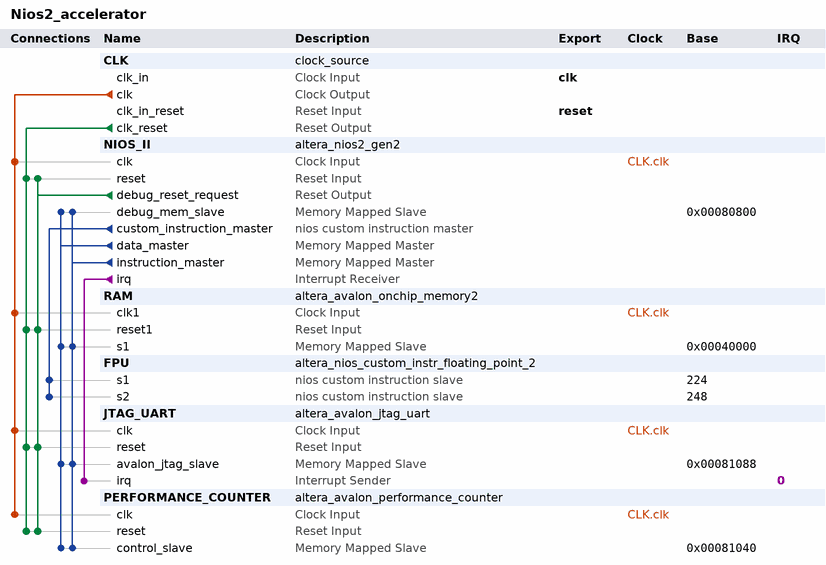
[diagram p0: system contents]
# Platform Designer (Qsys) system Nios2_accelerator, Cyclone V 5CEBA2F17A7
# Parameters at their usual value, and those the tool derives, are not listed.
package require -exact qsys 18.0
create_system Nios2_accelerator
set_project_property DEVICE_FAMILY {Cyclone V}
set_project_property DEVICE 5CEBA2F17A7

add_instance CLK clock_source 18.0
set_instance_parameter_value CLK clockFrequency 50000000

add_instance NIOS_II altera_nios2_gen2 18.0
set_instance_parameter_value NIOS_II dcache_size 2048
set_instance_parameter_value NIOS_II exceptionSlave RAM.s1
set_instance_parameter_value NIOS_II icache_size 4096
set_instance_parameter_value NIOS_II impl Tiny
set_instance_parameter_value NIOS_II resetSlave RAM.s1

add_instance RAM altera_avalon_onchip_memory2 18.0
set_instance_parameter_value RAM dataWidth 32
set_instance_parameter_value RAM dualPort false
set_instance_parameter_value RAM initMemContent true
set_instance_parameter_value RAM initializationFileName onchip_mem.hex
set_instance_parameter_value RAM memorySize 262144

add_instance FPU altera_nios_custom_instr_floating_point_2 18.0
set_instance_parameter_value FPU arithmetic_present true
set_instance_parameter_value FPU comparison_present false
set_instance_parameter_value FPU conversion_present true
set_instance_parameter_value FPU root_present false

add_instance JTAG_UART altera_avalon_jtag_uart 18.0
set_instance_parameter_value JTAG_UART simInteractiveOptions NO_INTERACTIVE_WINDOWS

add_instance PERFORMANCE_COUNTER altera_avalon_performance_counter 18.0
set_instance_parameter_value PERFORMANCE_COUNTER numberOfSections 3

# connections
add_connection CLK.clk JTAG_UART.clk clock
add_connection CLK.clk NIOS_II.clk clock
add_connection CLK.clk PERFORMANCE_COUNTER.clk clock
add_connection CLK.clk RAM.clk1 clock
add_connection CLK.clk_reset JTAG_UART.reset reset
add_connection CLK.clk_reset NIOS_II.reset reset
add_connection CLK.clk_reset PERFORMANCE_COUNTER.reset reset
add_connection CLK.clk_reset RAM.reset1 reset
add_connection NIOS_II.debug_reset_request JTAG_UART.reset reset
add_connection NIOS_II.debug_reset_request NIOS_II.reset reset
add_connection NIOS_II.debug_reset_request PERFORMANCE_COUNTER.reset reset
add_connection NIOS_II.debug_reset_request RAM.reset1 reset
add_connection NIOS_II.data_master JTAG_UART.avalon_jtag_slave avalon
set_connection_parameter_value NIOS_II.data_master/JTAG_UART.avalon_jtag_slave baseAddress 0x00081088
add_connection NIOS_II.data_master NIOS_II.debug_mem_slave avalon
set_connection_parameter_value NIOS_II.data_master/NIOS_II.debug_mem_slave baseAddress 0x00080800
add_connection NIOS_II.data_master PERFORMANCE_COUNTER.control_slave avalon
set_connection_parameter_value NIOS_II.data_master/PERFORMANCE_COUNTER.control_slave baseAddress 0x00081040
add_connection NIOS_II.data_master RAM.s1 avalon
set_connection_parameter_value NIOS_II.data_master/RAM.s1 baseAddress 0x00040000
add_connection NIOS_II.instruction_master JTAG_UART.avalon_jtag_slave avalon
set_connection_parameter_value NIOS_II.instruction_master/JTAG_UART.avalon_jtag_slave baseAddress 0x00081088
add_connection NIOS_II.instruction_master NIOS_II.debug_mem_slave avalon
set_connection_parameter_value NIOS_II.instruction_master/NIOS_II.debug_mem_slave baseAddress 0x00080800
add_connection NIOS_II.instruction_master PERFORMANCE_COUNTER.control_slave avalon
set_connection_parameter_value NIOS_II.instruction_master/PERFORMANCE_COUNTER.control_slave baseAddress 0x00081040
add_connection NIOS_II.instruction_master RAM.s1 avalon
set_connection_parameter_value NIOS_II.instruction_master/RAM.s1 baseAddress 0x00040000
add_connection NIOS_II.irq JTAG_UART.irq interrupt
set_connection_parameter_value NIOS_II.irq/JTAG_UART.irq irqNumber 0
add_connection NIOS_II.custom_instruction_master FPU.s1 nios_custom_instruction
set_connection_parameter_value NIOS_II.custom_instruction_master/FPU.s1 CIName fpu
set_connection_parameter_value NIOS_II.custom_instruction_master/FPU.s1 baseAddress 224
add_connection NIOS_II.custom_instruction_master FPU.s2 nios_custom_instruction
set_connection_parameter_value NIOS_II.custom_instruction_master/FPU.s2 CIName fpu_1
set_connection_parameter_value NIOS_II.custom_instruction_master/FPU.s2 baseAddress 248

# exported interfaces
add_interface clk clock sink
set_interface_property clk EXPORT_OF CLK.clk_in
add_interface reset reset sink
set_interface_property reset EXPORT_OF CLK.clk_in_reset

set_interconnect_requirement {$system} qsys_mm.clockCrossingAdapter HANDSHAKE
set_interconnect_requirement {$system} qsys_mm.enableEccProtection FALSE
set_interconnect_requirement {$system} qsys_mm.insertDefaultSlave FALSE
set_interconnect_requirement {$system} qsys_mm.maxAdditionalLatency 1

save_system Nios2_accelerator.qsys
